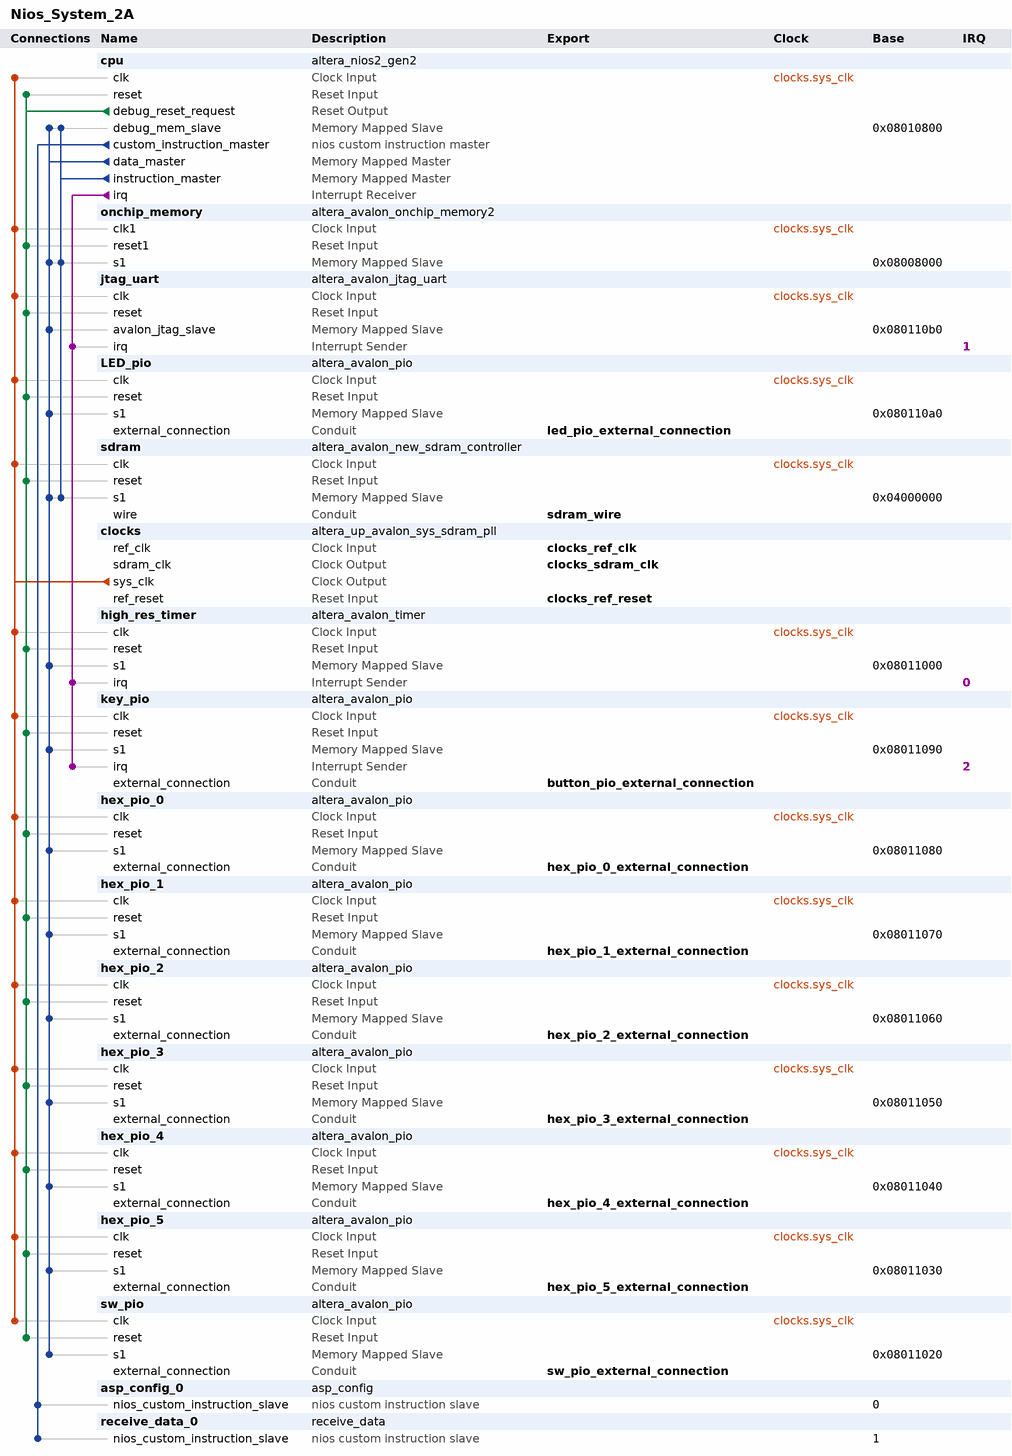
[diagram p0: system contents]
# Platform Designer (Qsys) system Nios_System_2A, Cyclone V 5CSEMA5F31C6
# Parameters at their usual value, and those the tool derives, are not listed.
package require -exact qsys 18.1
create_system Nios_System_2A
set_project_property DEVICE_FAMILY {Cyclone V}
set_project_property DEVICE 5CSEMA5F31C6

add_instance cpu altera_nios2_gen2 18.1
set_instance_parameter_value cpu cpuID 1
set_instance_parameter_value cpu dcache_size 0
set_instance_parameter_value cpu exceptionSlave sdram.s1
set_instance_parameter_value cpu icache_size 0
set_instance_parameter_value cpu impl Tiny
set_instance_parameter_value cpu resetSlave sdram.s1

add_instance onchip_memory altera_avalon_onchip_memory2 18.1
set_instance_parameter_value onchip_memory dataWidth 32
set_instance_parameter_value onchip_memory dualPort false
set_instance_parameter_value onchip_memory initMemContent true
set_instance_parameter_value onchip_memory initializationFileName onchip_mem.hex
set_instance_parameter_value onchip_memory memorySize 20480

add_instance jtag_uart altera_avalon_jtag_uart 18.1
set_instance_parameter_value jtag_uart simInteractiveOptions NO_INTERACTIVE_WINDOWS

add_instance LED_pio altera_avalon_pio 18.1
set_instance_parameter_value LED_pio direction Output
set_instance_parameter_value LED_pio width 10

add_instance sdram altera_avalon_new_sdram_controller 18.1
set_instance_parameter_value sdram TAC 5.4
set_instance_parameter_value sdram TRCD 15.0
set_instance_parameter_value sdram TRP 15.0
set_instance_parameter_value sdram casLatency 3
set_instance_parameter_value sdram columnWidth 10
set_instance_parameter_value sdram dataWidth 16
set_instance_parameter_value sdram generateSimulationModel false
set_instance_parameter_value sdram model single_Micron_MT48LC4M32B2_7_chip
set_instance_parameter_value sdram numberOfBanks 4
set_instance_parameter_value sdram numberOfChipSelects 1
set_instance_parameter_value sdram powerUpDelay 100.0
set_instance_parameter_value sdram refreshPeriod 7.8125
set_instance_parameter_value sdram rowWidth 13

add_instance clocks altera_up_avalon_sys_sdram_pll 18.0
set_instance_parameter_value clocks CV_boards DE1-SoC
set_instance_parameter_value clocks gui_outclk 50.0
set_instance_parameter_value clocks gui_refclk 50.0

add_instance high_res_timer altera_avalon_timer 18.1
set_instance_parameter_value high_res_timer period 1
set_instance_parameter_value high_res_timer periodUnits MSEC

add_instance key_pio altera_avalon_pio 18.1
set_instance_parameter_value key_pio captureEdge true
set_instance_parameter_value key_pio direction Input
set_instance_parameter_value key_pio generateIRQ true
set_instance_parameter_value key_pio irqType EDGE
set_instance_parameter_value key_pio width 4

add_instance hex_pio_0 altera_avalon_pio 18.1
set_instance_parameter_value hex_pio_0 direction Output
set_instance_parameter_value hex_pio_0 width 8

add_instance hex_pio_1 altera_avalon_pio 18.1
set_instance_parameter_value hex_pio_1 direction Output
set_instance_parameter_value hex_pio_1 width 8

add_instance hex_pio_2 altera_avalon_pio 18.1
set_instance_parameter_value hex_pio_2 direction Output
set_instance_parameter_value hex_pio_2 width 8

add_instance hex_pio_3 altera_avalon_pio 18.1
set_instance_parameter_value hex_pio_3 direction Output
set_instance_parameter_value hex_pio_3 width 8

add_instance hex_pio_4 altera_avalon_pio 18.1
set_instance_parameter_value hex_pio_4 direction Output
set_instance_parameter_value hex_pio_4 width 8

add_instance hex_pio_5 altera_avalon_pio 18.1
set_instance_parameter_value hex_pio_5 direction Output
set_instance_parameter_value hex_pio_5 width 8

add_instance sw_pio altera_avalon_pio 18.1
set_instance_parameter_value sw_pio captureEdge true
set_instance_parameter_value sw_pio direction Input
set_instance_parameter_value sw_pio irqType EDGE
set_instance_parameter_value sw_pio width 10

add_instance asp_config_0 asp_config 1.5

add_instance receive_data_0 receive_data 1.6

# connections
add_connection clocks.sys_clk cpu.clk clock
add_connection clocks.sys_clk hex_pio_0.clk clock
add_connection clocks.sys_clk hex_pio_1.clk clock
add_connection clocks.sys_clk hex_pio_2.clk clock
add_connection clocks.sys_clk hex_pio_3.clk clock
add_connection clocks.sys_clk hex_pio_4.clk clock
add_connection clocks.sys_clk hex_pio_5.clk clock
add_connection clocks.sys_clk high_res_timer.clk clock
add_connection clocks.sys_clk jtag_uart.clk clock
add_connection clocks.sys_clk key_pio.clk clock
add_connection clocks.sys_clk LED_pio.clk clock
add_connection clocks.sys_clk onchip_memory.clk1 clock
add_connection clocks.sys_clk sdram.clk clock
add_connection clocks.sys_clk sw_pio.clk clock
add_connection cpu.debug_reset_request cpu.reset reset
add_connection cpu.debug_reset_request hex_pio_0.reset reset
add_connection cpu.debug_reset_request hex_pio_1.reset reset
add_connection cpu.debug_reset_request hex_pio_2.reset reset
add_connection cpu.debug_reset_request hex_pio_3.reset reset
add_connection cpu.debug_reset_request hex_pio_4.reset reset
add_connection cpu.debug_reset_request hex_pio_5.reset reset
add_connection cpu.debug_reset_request high_res_timer.reset reset
add_connection cpu.debug_reset_request jtag_uart.reset reset
add_connection cpu.debug_reset_request key_pio.reset reset
add_connection cpu.debug_reset_request LED_pio.reset reset
add_connection cpu.debug_reset_request onchip_memory.reset1 reset
add_connection cpu.debug_reset_request sdram.reset reset
add_connection cpu.debug_reset_request sw_pio.reset reset
add_connection cpu.data_master cpu.debug_mem_slave avalon
set_connection_parameter_value cpu.data_master/cpu.debug_mem_slave baseAddress 0x08010800
add_connection cpu.data_master hex_pio_0.s1 avalon
set_connection_parameter_value cpu.data_master/hex_pio_0.s1 baseAddress 0x08011080
add_connection cpu.data_master hex_pio_1.s1 avalon
set_connection_parameter_value cpu.data_master/hex_pio_1.s1 baseAddress 0x08011070
add_connection cpu.data_master hex_pio_2.s1 avalon
set_connection_parameter_value cpu.data_master/hex_pio_2.s1 baseAddress 0x08011060
add_connection cpu.data_master hex_pio_3.s1 avalon
set_connection_parameter_value cpu.data_master/hex_pio_3.s1 baseAddress 0x08011050
add_connection cpu.data_master hex_pio_4.s1 avalon
set_connection_parameter_value cpu.data_master/hex_pio_4.s1 baseAddress 0x08011040
add_connection cpu.data_master hex_pio_5.s1 avalon
set_connection_parameter_value cpu.data_master/hex_pio_5.s1 baseAddress 0x08011030
add_connection cpu.data_master high_res_timer.s1 avalon
set_connection_parameter_value cpu.data_master/high_res_timer.s1 baseAddress 0x08011000
add_connection cpu.data_master jtag_uart.avalon_jtag_slave avalon
set_connection_parameter_value cpu.data_master/jtag_uart.avalon_jtag_slave baseAddress 0x080110b0
add_connection cpu.data_master key_pio.s1 avalon
set_connection_parameter_value cpu.data_master/key_pio.s1 baseAddress 0x08011090
add_connection cpu.data_master LED_pio.s1 avalon
set_connection_parameter_value cpu.data_master/LED_pio.s1 baseAddress 0x080110a0
add_connection cpu.data_master onchip_memory.s1 avalon
set_connection_parameter_value cpu.data_master/onchip_memory.s1 baseAddress 0x08008000
add_connection cpu.data_master sdram.s1 avalon
set_connection_parameter_value cpu.data_master/sdram.s1 baseAddress 0x04000000
add_connection cpu.data_master sw_pio.s1 avalon
set_connection_parameter_value cpu.data_master/sw_pio.s1 baseAddress 0x08011020
add_connection cpu.instruction_master cpu.debug_mem_slave avalon
set_connection_parameter_value cpu.instruction_master/cpu.debug_mem_slave baseAddress 0x08010800
add_connection cpu.instruction_master onchip_memory.s1 avalon
set_connection_parameter_value cpu.instruction_master/onchip_memory.s1 baseAddress 0x08008000
add_connection cpu.instruction_master sdram.s1 avalon
set_connection_parameter_value cpu.instruction_master/sdram.s1 baseAddress 0x04000000
add_connection cpu.irq high_res_timer.irq interrupt
set_connection_parameter_value cpu.irq/high_res_timer.irq irqNumber 0
add_connection cpu.irq jtag_uart.irq interrupt
set_connection_parameter_value cpu.irq/jtag_uart.irq irqNumber 1
add_connection cpu.irq key_pio.irq interrupt
set_connection_parameter_value cpu.irq/key_pio.irq irqNumber 2
add_connection cpu.custom_instruction_master asp_config_0.nios_custom_instruction_slave nios_custom_instruction
set_connection_parameter_value cpu.custom_instruction_master/asp_config_0.nios_custom_instruction_slave CIName asp_config_0
set_connection_parameter_value cpu.custom_instruction_master/asp_config_0.nios_custom_instruction_slave baseAddress 0
add_connection cpu.custom_instruction_master receive_data_0.nios_custom_instruction_slave nios_custom_instruction
set_connection_parameter_value cpu.custom_instruction_master/receive_data_0.nios_custom_instruction_slave CIName receive_data_0
set_connection_parameter_value cpu.custom_instruction_master/receive_data_0.nios_custom_instruction_slave baseAddress 1

# exported interfaces
add_interface button_pio_external_connection conduit end
set_interface_property button_pio_external_connection EXPORT_OF key_pio.external_connection
add_interface clocks_ref_clk clock sink
set_interface_property clocks_ref_clk EXPORT_OF clocks.ref_clk
add_interface clocks_ref_reset reset sink
set_interface_property clocks_ref_reset EXPORT_OF clocks.ref_reset
add_interface clocks_sdram_clk clock source
set_interface_property clocks_sdram_clk EXPORT_OF clocks.sdram_clk
add_interface hex_pio_0_external_connection conduit end
set_interface_property hex_pio_0_external_connection EXPORT_OF hex_pio_0.external_connection
add_interface hex_pio_1_external_connection conduit end
set_interface_property hex_pio_1_external_connection EXPORT_OF hex_pio_1.external_connection
add_interface hex_pio_2_external_connection conduit end
set_interface_property hex_pio_2_external_connection EXPORT_OF hex_pio_2.external_connection
add_interface hex_pio_3_external_connection conduit end
set_interface_property hex_pio_3_external_connection EXPORT_OF hex_pio_3.external_connection
add_interface hex_pio_4_external_connection conduit end
set_interface_property hex_pio_4_external_connection EXPORT_OF hex_pio_4.external_connection
add_interface hex_pio_5_external_connection conduit end
set_interface_property hex_pio_5_external_connection EXPORT_OF hex_pio_5.external_connection
add_interface led_pio_external_connection conduit end
set_interface_property led_pio_external_connection EXPORT_OF LED_pio.external_connection
add_interface sdram_wire conduit end
set_interface_property sdram_wire EXPORT_OF sdram.wire
add_interface sw_pio_external_connection conduit end
set_interface_property sw_pio_external_connection EXPORT_OF sw_pio.external_connection

set_interconnect_requirement {$system} qsys_mm.clockCrossingAdapter HANDSHAKE
set_interconnect_requirement {$system} qsys_mm.enableEccProtection FALSE
set_interconnect_requirement {$system} qsys_mm.insertDefaultSlave FALSE
set_interconnect_requirement {$system} qsys_mm.maxAdditionalLatency 1

save_system Nios_System_2A.qsys
